# EAGLE design Patch panel module - CAT6 (EAGLE 7.2.0)
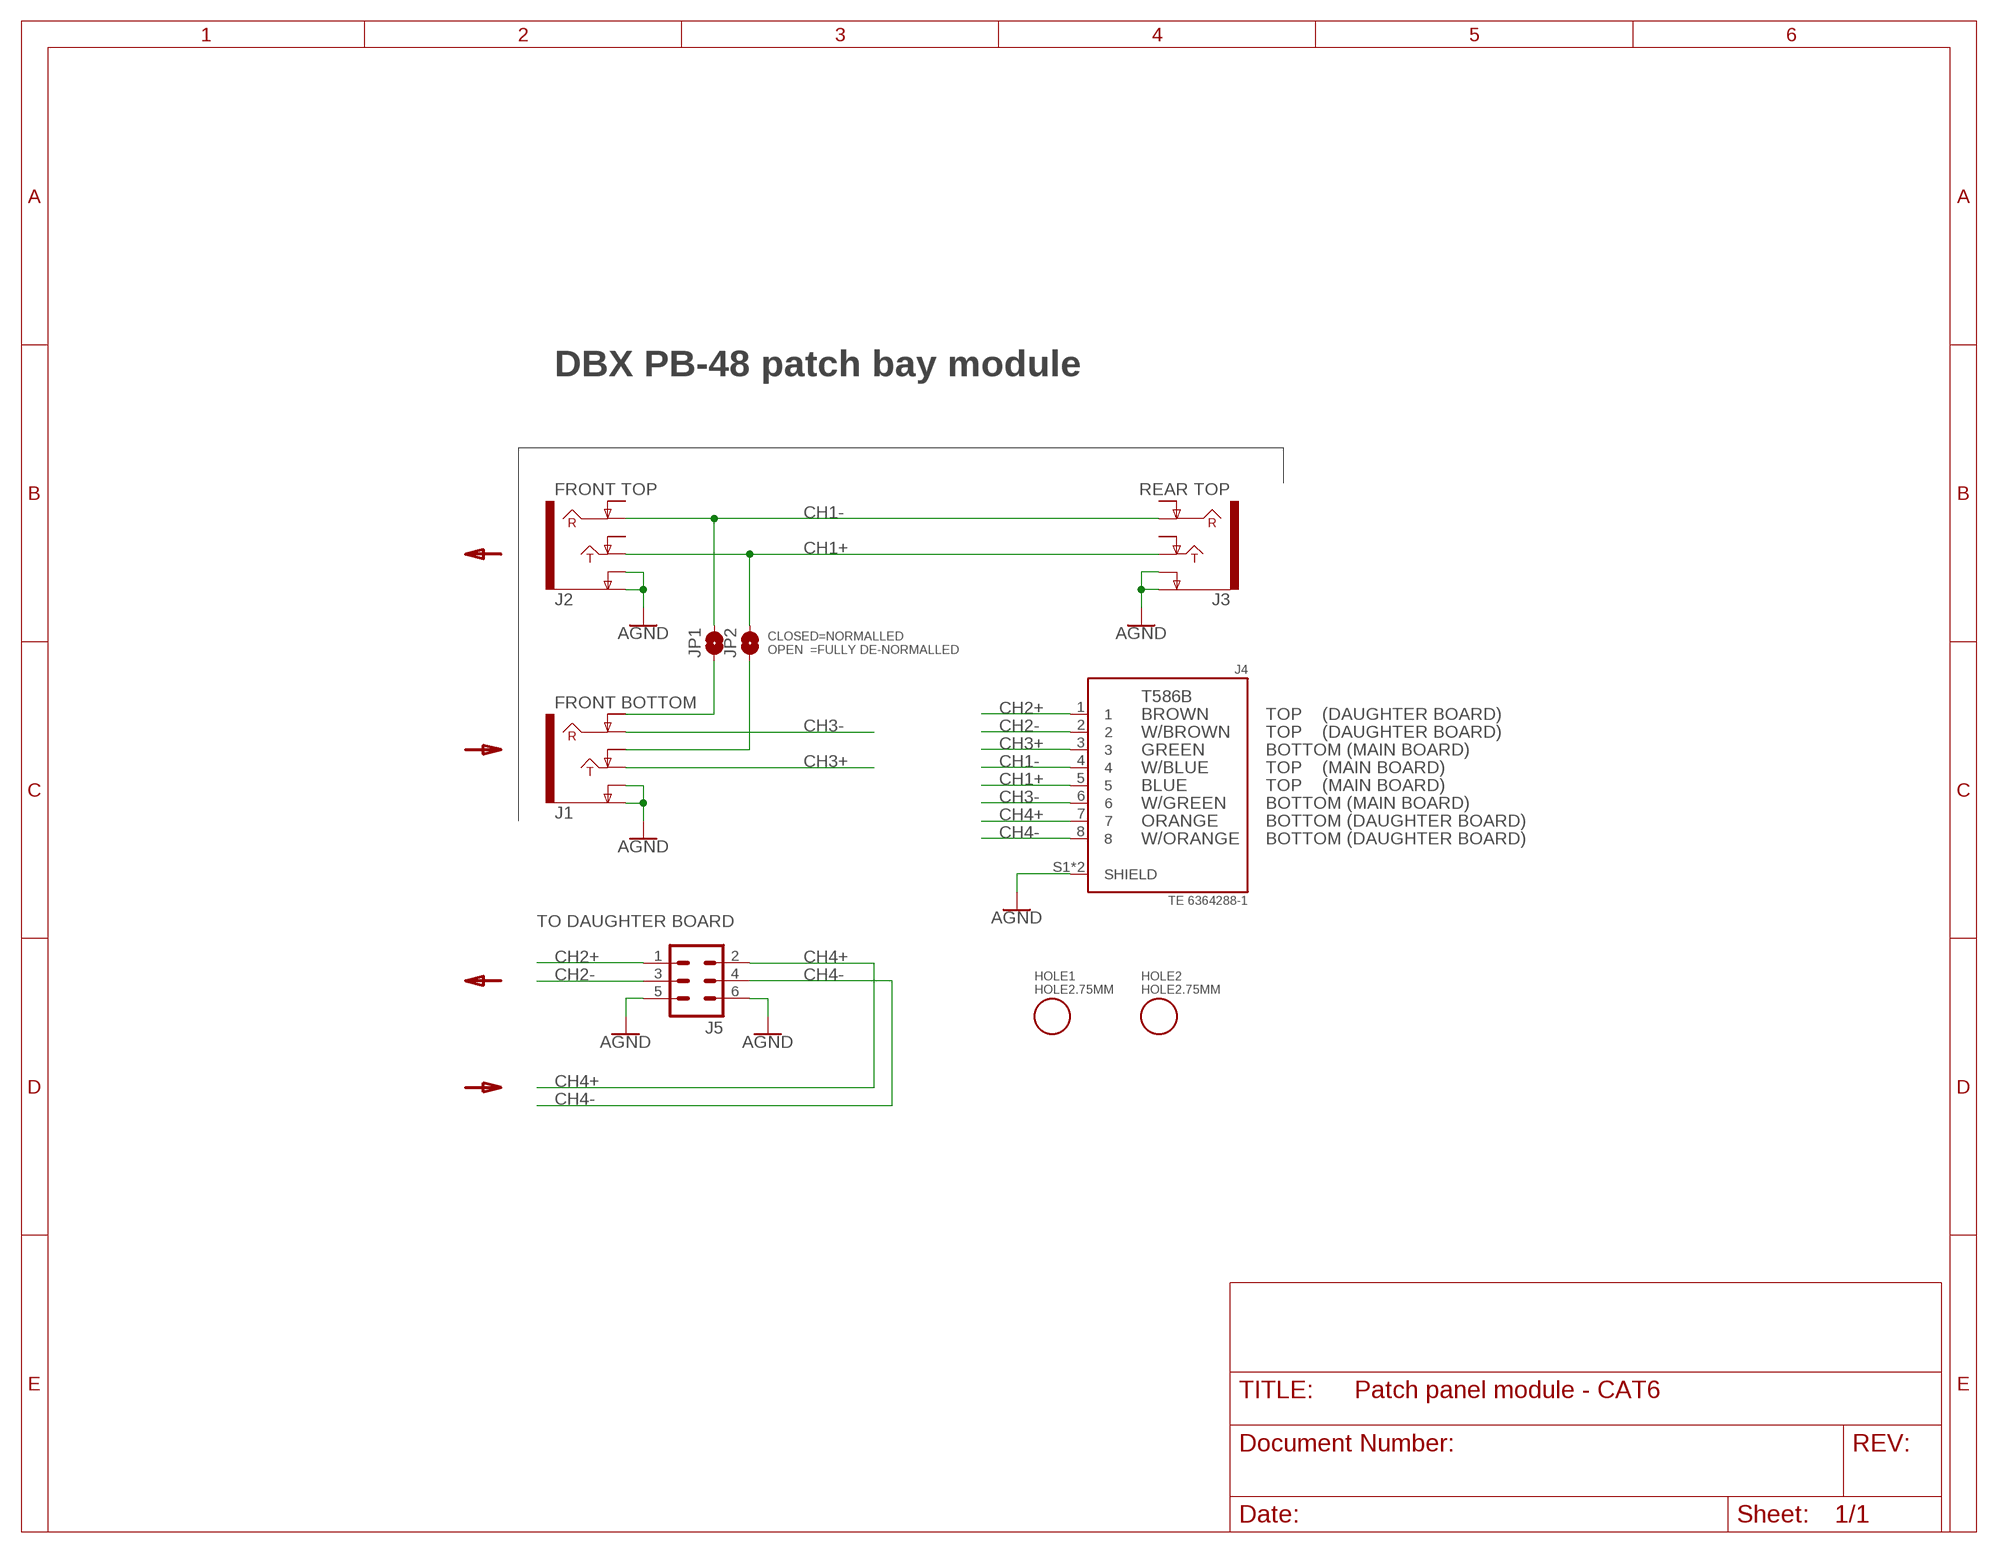
[diagram p0: schematic, sheet 1]

## Parts
HOLE1  HOLE2.75MM  [HOLE-2.75MM]
HOLE2  HOLE2.75MM  [HOLE-2.75MM]
J1  FRONT BOTTOM  AUDIO_JACK_TRS_0.25"_PTH_RA-NRJ6HM  [NEUTRIK-NRJ6HF]
J2  FRONT TOP  AUDIO_JACK_TRS_0.25"_PTH_RA-NRJ6HM  [NEUTRIK-NRJ6HF]
J3  REAR TOP  AUDIO_JACK_TRS_0.25"_PTH_RA-NRJ6HM  [NEUTRIK-NRJ6HF]
J4  TE 6364288-1  RJ45-SHIELDED-TE-6364288-1  [RJ45-TE-6364288-1]
J5  MA03-2  [MA03-2]
JP1  JUMPER-SMT_2_NO_NO-SILK_ROUND  [SMT-JUMPER_2_NO_NO-SILK_ROUND]
JP2  JUMPER-SMT_2_NO_NO-SILK_ROUND  [SMT-JUMPER_2_NO_NO-SILK_ROUND]

## Nets
AGND: J1.S(EARTH) J1.SN(EARTH-NORM) J2.S(EARTH) J2.SN(EARTH-NORM) J3.S(EARTH) J3.SN(EARTH-NORM) J4.S1(SHIELD) J4.S2(SHIELD) J5.5 J5.6
CH1+: J2.T(TIP) J3.T(TIP) J4.5 JP2.2
CH1-: J2.R(RING) J3.R(RING) J4.4 JP1.2
CH2+: J4.1 J5.1
CH2-: J4.2 J5.3
CH3+: J1.T(TIP) J4.3
CH3-: J1.R(RING) J4.6
CH4+: J4.7 J5.2
CH4-: J4.8 J5.4
N$1: J1.RN(RING-NORM) JP1.1
N$2: J1.TN(TIP-NORM) JP2.1
Unconnected: J2.RN(RING-NORM) J2.TN(TIP-NORM) J3.RN(RING-NORM) J3.TN(TIP-NORM)

## Notes on the sheet
- DBX PB-48 patch bay module
- CLOSED=NORMALLED
  OPEN  =FULLY DE-NORMALLED
- TOP    (DAUGHTER BOARD)
- TOP    (DAUGHTER BOARD)
- BOTTOM (MAIN BOARD)
- TOP    (MAIN BOARD)
- TOP    (MAIN BOARD)
- BOTTOM (MAIN BOARD)
- BOTTOM (DAUGHTER BOARD)
- BOTTOM (DAUGHTER BOARD)
- TO DAUGHTER BOARD

## Library data of the parts
HOLE1 HOLE2 = !frankendeck:HOLE
J1-J3 = !frankendeck:AUDIO_JACK_TRS_0.25"_PTH_RA: Audio Jack, 1/4" TRS jack, horizontal, PTH, aka "Phono jack" Find the connector here: Audio Jack - 1/4" Stereo (right angle) <https://www.sparkfun.com/products/11144> (COM-11144) Datasheet <http://cdn.sparkfun.com/datasheets/Components/General/JP-611%20DD.jpg> Note, although the datasheet and physical part are slightly different, this footprint was proven to mate well on the Proto Pedal. This device is used on these SparkFun Products: SparkFun TRS Jack Breakout - 1/4" Stereo <https://www.sparkfun.com/products/13005> (BOB-13005 ) SparkFun Proto Pedal - sorry bad link - product comming soon! <https://www.sparkfun.com/products/13124> (PRT-13124); PROD_ID: CONN-12339; SF_ID: COM-11144
J4 = !frankendeck:RJ45-SHIELDED
J5 = !con-lstb:MA03-2: PIN HEADER
JP1 JP2 = !frankendeck:JUMPER-SMT_2_NO: Normally open jumper This jumper has two pads in close proximity to each other. Apply solder to close the connection. Round pads are easier to solder for beginners, but are a lot larger. SparkFun Product that uses the round pads: SparkFun EL Sequencer <https://www.sparkfun.com/products/12781>

## Board
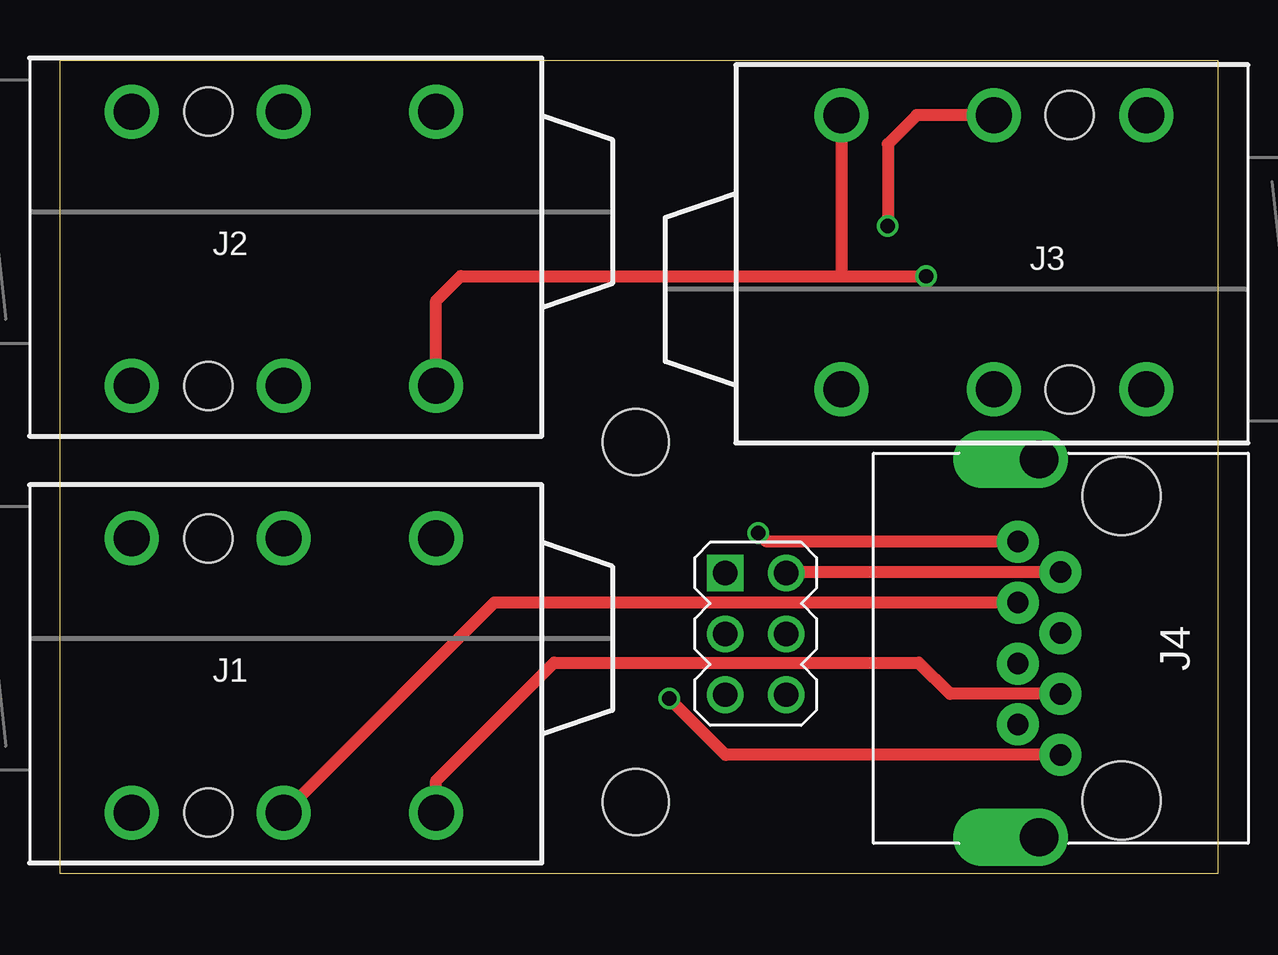
[diagram p1: board, top side]
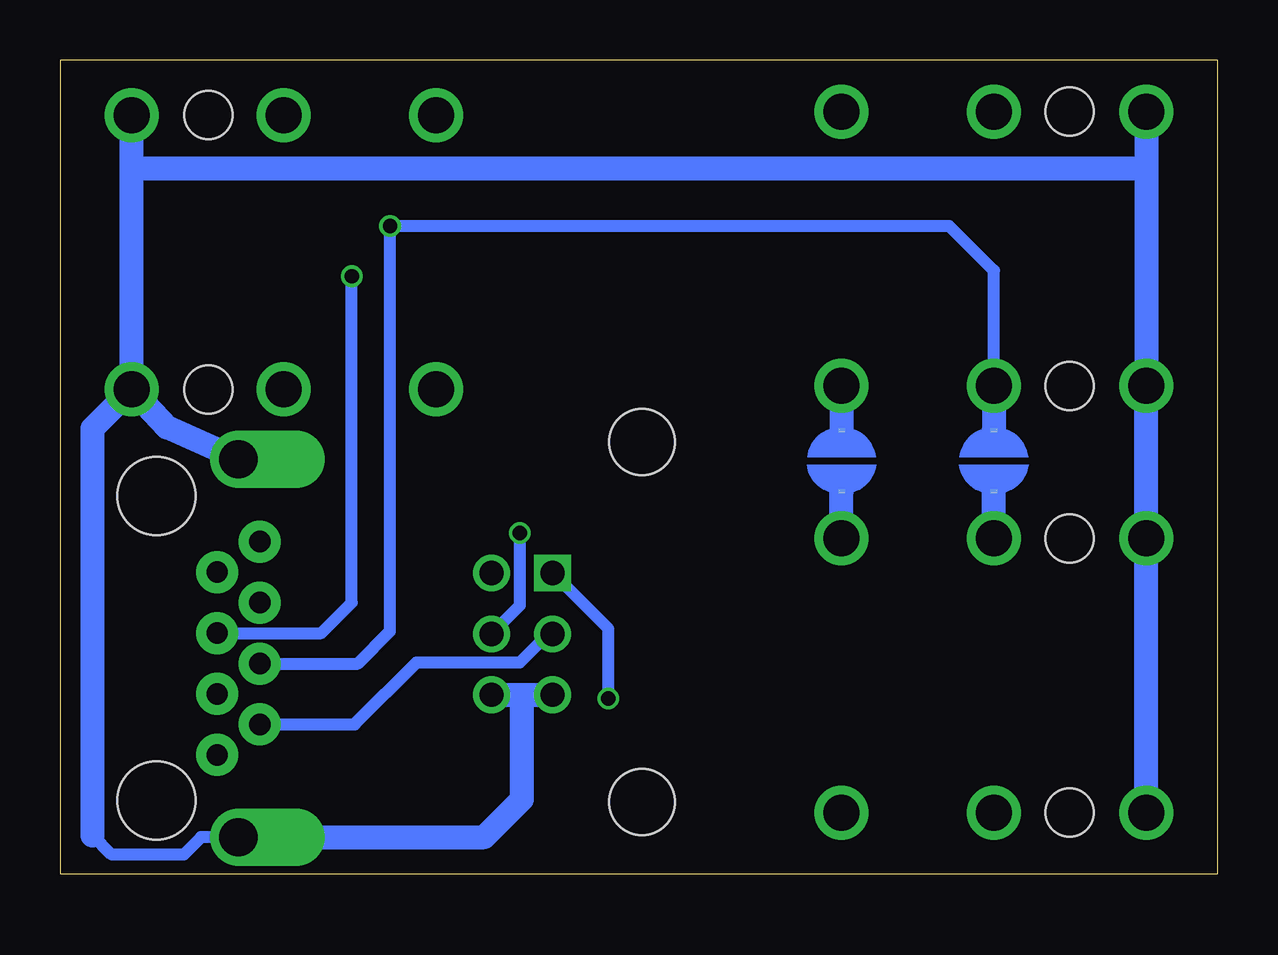
[diagram p2: board, bottom side, seen from below]

Size 48.26 x 33.91 mm. Coordinates in mm from the lower left corner, seen from the top.
Outline: 0,33.91 48.26,33.91 48.26,0 0,0 0,33.91
Copper layers (1*16): Top 0.035559375mm / dielectric 1.6mm / Bottom 0.035559375mm
Design rules "jlcpcb2layer": minimum track width 5mil, minimum drill 12mil, track to track 5mil, track to pad 5mil, pad to pad 5mil, via to via 5mil, smd to smd 5mil, copper to edge 8mil, drill to drill 6mil, minimum pad ring 5mil, minimum via ring 3mil, stop-mask expansion 2.5mil, vias tented up to drill 15mil, thermal gap 10mil

### Footprints (pad centres in the part's own frame; a part is rotated, then mirrored left to right if it is on the bottom)
HOLE-2.75MM = hole 2.75: 0,0
NEUTRIK-NRJ6HF = drill 1.5: R -10.6,7.23; RN -10.6,-4.2; S -4.25,7.23; SN -4.25,-4.2; T -16.95,7.23; TN -16.95,-4.2 | hole 2: -7.45,7.23; -7.45,-4.2
RJ45-TE-6364288-1 = drill 0.889 pad 1.75: 1 -4.445,7.823; 2 -3.175,9.601; 3 -1.905,7.823; 4 -0.635,9.601; 5 0.635,7.823; 6 1.905,9.601; 7 3.175,7.823; 8 4.445,9.601 | drill 1.6 pad 1.905 offset: S1 -7.874,8.712; S2 7.874,8.712 | hole 3.251: -6.35,5.283; 6.35,5.283
MA03-2 = drill 1.016 square: 1 -2.54,-1.27 | drill 1.016: 2 -2.54,1.27; 3 0,-1.27; 4 0,1.27; 5 2.54,-1.27; 6 2.54,1.27
SMT-JUMPER_2_NO_NO-SILK_ROUND = smd 0.152 x 0.305: 1 -1.27,0; 2 1.27,0

### Placement (x,y rotation side)
HOLE1  24,18 0 top
HOLE2  24,3 0 top
J1  -1.27,9.78 180 top
J2  -1.27,27.56 180 top
J3  49.53,24.38 0 top
J4  49.53,9.4 90 top
J5  29,10 270 top
JP1  9.33,17.21 90 bottom
JP2  15.68,17.21 90 bottom

### Tracks (layer width: path | path; a pad name or v marks a point on that pad's centre or on a via)
AGND
  Bottom 0.5: J4.S1 42.38,1.52 43.1,0.8 46.1,0.8 46.9,1.6
  Bottom 1: J2.SN 2.98,29.5 | 2.98,29.5 J2.S J1.SN J1.S | 45.28,29.4 3.08,29.4 2.98,29.5 | J5.6 29.1,7.46 | 29.1,7.46 J5.5 | 46.9,1.6 46.9,18.56 J3.SN | J3.SN 45.28,29.4 | 45.28,29.4 J3.S | J4.S2 43.8,18.6 J3.SN | J4.S1 30.58,1.52 29,3.1 29,7.36 29.1,7.46
CH1+  (via drill 0.6)
  Top 0.5: J2.T 15.68,23.88 16.7,24.9 32.5,24.9 | 32.5,24.9 v36.1,24.9 | J3.T 32.58,24.98 32.5,24.9
  Bottom 0.5: J4.5 37.37,10.03 36.1,11.3 v36.1,24.9
  Bottom 1: J2.T JP2.2
CH1-  (via drill 0.6)
  Top 0.5: J3.R 35.71,31.61 34.5,30.4 v34.5,27
  Bottom 0.5: J4.4 35.84,8.76 34.5,10.1 v34.5,27 11.2,27 9.33,25.13 J2.R
  Bottom 1: J2.R JP1.2
CH2+  (via drill 0.6)
  Top 0.5: J4.1 27.75,4.95 v25.4,7.3
  Bottom 0.5: v25.4,7.3 25.4,10.21 J5.1
CH2-
  Bottom 0.5: J5.3 27.9,10 29.1,8.8 33.4,8.8 35.98,6.22 J4.2
CH3+
  Top 0.5: J4.3 37.11,7.49 35.8,8.8 20.6,8.8 15.68,3.88 J1.T
CH3-
  Top 0.5: J4.6 18.1,11.3 9.35,2.55 J1.R
CH4+
  Top 0.5: J4.7 30.3,12.57 J5.2
CH4-  (via drill 0.6)
  Top 0.5: J4.8 29.46,13.84 v29.1,14.2
  Bottom 0.5: v29.1,14.2 29.1,11.17 J5.4
N$1
  Bottom 1: J1.RN JP1.1
N$2
  Bottom 1: J1.TN JP2.1